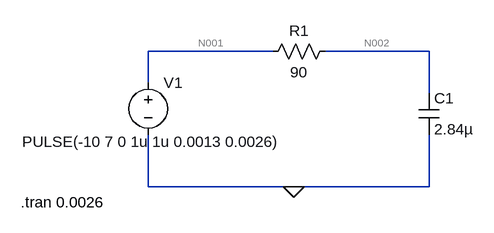
[diagram p0: schematic Draft3.asc]
Draft3.asc, the LTspice schematic file:
Version 4
SHEET 1 880 680
WIRE 224 64 32 64
WIRE 464 64 304 64
WIRE 32 112 32 64
WIRE 464 128 464 64
WIRE 32 272 32 192
WIRE 256 272 32 272
WIRE 464 272 464 192
WIRE 464 272 256 272
FLAG 256 272 0
SYMBOL voltage 32 96 R0
WINDOW 3 -194 107 Left 2
WINDOW 123 0 0 Left 0
WINDOW 39 0 0 Left 0
SYMATTR InstName V1
SYMATTR Value PULSE(-10 7 0 1u 1u 0.0013 0.0026)
SYMBOL res 320 48 R90
WINDOW 0 0 56 VBottom 2
WINDOW 3 32 56 VTop 2
SYMATTR InstName R1
SYMATTR Value 90
SYMBOL cap 448 128 R0
SYMATTR InstName C1
SYMATTR Value 2.84µ
TEXT -164 296 Left 2 !.tran 0.0026

The netlist it stands for:
* Draft3.asc
V1 N001 0 PULSE(-10 7 0 1u 1u 0.0013 0.0026)
R1 N002 N001 90
C1 N002 0 2.84µ
.tran 0.0026
.backanno
.end

* Results of the author's LTspice run, read from the files saved beside the schematic
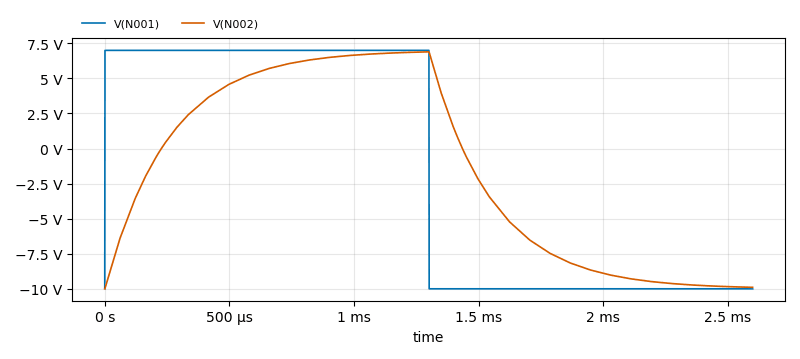
[diagram p1: Transient Analysis of Draft3.asc, plotted from the saved traces]
* Transient Analysis, 1 run:
*   V(N001): min -10 V, max 7 V, average -1.493 V, rms 8.63 V, last -10 V
*   V(N002): min -10 V, max 6.895 V, average -1.504 V, rms 6.827 V, last -9.895 V